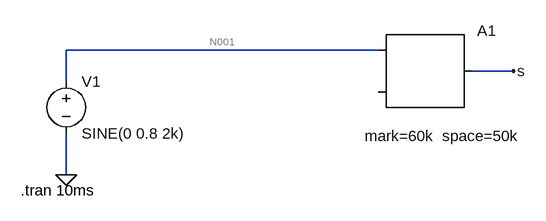
[diagram p0: schematic Draft1.asc]
Draft1.asc, the LTspice schematic file:
Version 4
SHEET 1 880 680
WIRE 368 96 -112 96
WIRE 576 128 512 128
WIRE -112 144 -112 96
WIRE -112 288 -112 224
FLAG 576 128 s
FLAG -112 288 0
SYMBOL SpecialFunctions\\modulate 368 96 R0
WINDOW 3 -21 132 Left 2
SYMATTR Value mark=60k  space=50k
SYMATTR InstName A1
SYMBOL voltage -112 128 R0
WINDOW 123 0 0 Left 0
WINDOW 39 0 0 Left 0
SYMATTR InstName V1
SYMATTR Value SINE(0 0.8 2k)
TEXT -182 312 Left 2 !.tran 10ms

The netlist it stands for:
* Draft1.asc
A1 N001 0 0 0 0 0 s 0 MODULATOR mark=60k  space=50k
V1 N001 0 SINE(0 0.8 2k)
.tran 10ms
.backanno
.end

* Results of the author's LTspice run, read from the files saved beside the schematic
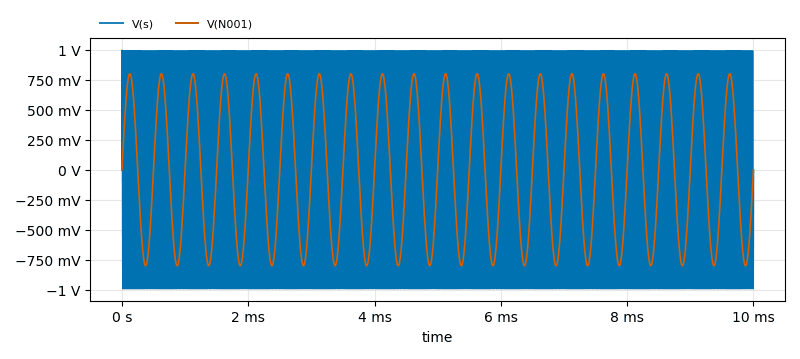
[diagram p1: Transient Analysis of Draft1.asc, plotted from the saved traces]
* Transient Analysis, 1 run:
*   V(s): min -992.2 mV, max 995 mV, average 2.51 µV, rms 719.3 mV, last -2.933 mV
*   V(N001): min -800 mV, max 800 mV, average 4.242 µV, rms 565.7 mV, last 0 V